# EasyEDA schematic SCH_USB_TO_TTL_CONVERTOR.json
TITLE: Sheet_1; REV: 1.0; Date: 2024-04-29; Sheet: 1/1; Drawn By: janardhanbv; Company: Your Company
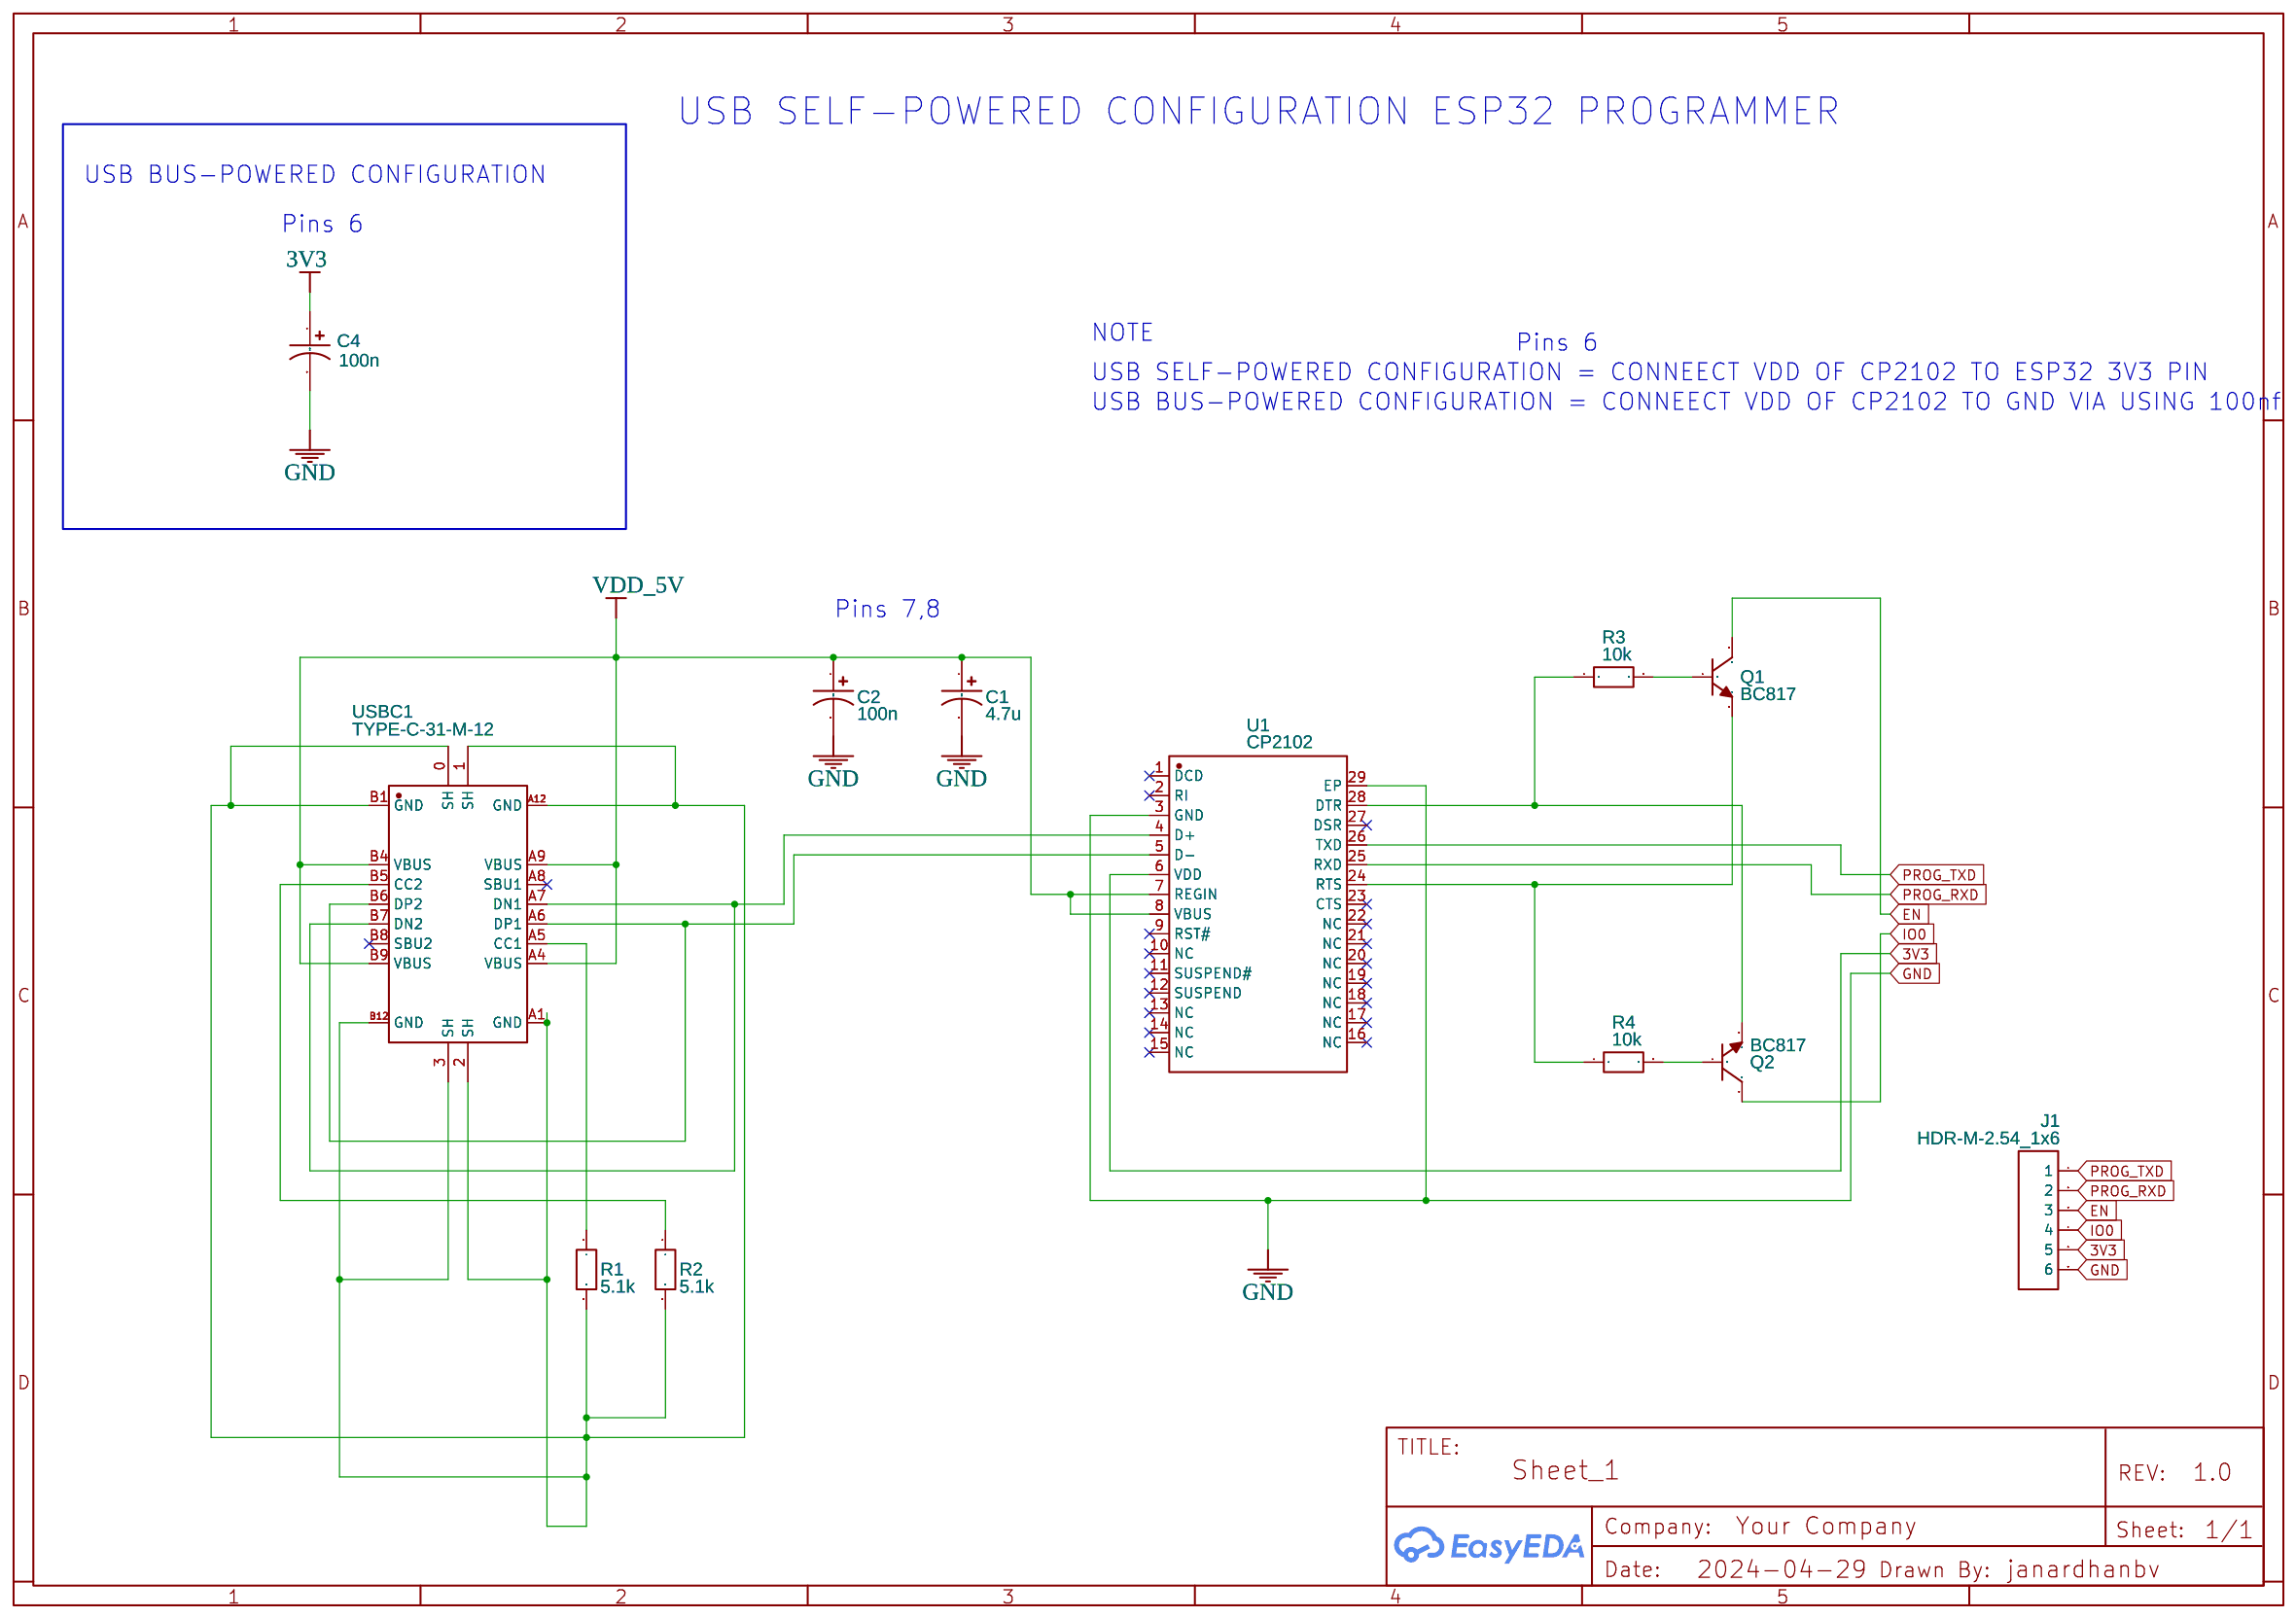
[diagram p0: schematic sheet]

## Parts
C1  4.7u  [CASE-A_3216]
C2  100n  [CASE-A_3216]
C4  100n  [CASE-A_3216]
J1  HDR-M-2.54_1x6  [HDR-M-2.54_1X6]
Q1  BC817  [SOT-23-3_L2.9-W1.3-P1.90-LS2.4-BR]
Q2  BC817  [SOT-23-3_L2.9-W1.3-P1.90-LS2.4-BR]
R1  5.1k  [R0603]
R2  5.1k  [R0603]
R3  10k  [R0603]
R4  10k  [R0603]
U1  CP2102  [QFN-28_L5.0-W5.0-P0.50-TL-EP3.2]
USBC1  TYPE-C-31-M-12  [USB-C_SMD-TYPE-C-31-M-12]

## Library data of the parts
C1 C2 C4 = C_Tan_SMD_A_US: Contributor: LCEDA_Lib
J1 = HDR-M-2.54_1x6: Supplier Part: C190819; Supplier: LCSC; Contributor: LCEDA_Lib
Q1 Q2 = BC817: Supplier: LCSC; Manufacturer: CJ(江苏长电/长晶); Manufacturer Part: BC817-40; Supplier Part: C8589; JLCPCB Part Class: Extended Part
R1-R4 = R_0603_EU: Contributor: LCEDA_Lib
U1 = CP2102: Contributor: LCSC; Supplier: LCSC; Supplier Part: C9900004371; Manufacturer: null
USBC1 = TYPE-C-31-M-12: Contributor: LCSC; Supplier: LCSC; Supplier Part: C165948; Manufacturer: 韩国韩荣; JLCPCB Part Class: Extended Part

## Nets
3V3: C4.1 J1.5 U1.6(VDD)
GND: C1.2 C2.2 C4.2 J1.6 U1.3(GND) U1.29(EP)
VDD_5V: C1.1 C2.1 U1.7(REGIN) U1.8(VBUS) USBC1.A4(VBUS) USBC1.A9(VBUS) USBC1.B4(VBUS) USBC1.B9(VBUS)
EN: J1.3 Q1.3(C)
IO0: J1.4 Q2.3(C)
PROG_RXD: J1.2 U1.25(RXD)
PROG_TXD: J1.1 U1.26(TXD)
Net-(Q1-1): Q1.1(B) R3.2
Net-(Q1-2): Q1.2(E) R4.1 U1.24(RTS)
Net-(Q2-1): Q2.1(B) R4.2
Net-(Q2-2): Q2.2(E) R3.1 U1.28(DTR)
Net-(R1-1): R1.1 USBC1.A5(CC1)
Net-(R1-2): R1.2 R2.2 USBC1.0(SH) USBC1.1(SH) USBC1.2(SH) USBC1.3(SH) USBC1.A1(GND) USBC1.A12(GND) USBC1.B1(GND) USBC1.B12(GND)
Net-(R2-1): R2.1 USBC1.B5(CC2)
Net-(U1-4): U1.4(D+) USBC1.A7(DN1) USBC1.B7(DN2)
Net-(U1-5): U1.5(D-) USBC1.A6(DP1) USBC1.B6(DP2)

Not connected (* = marked no-connect by the designer): U1 1(DCD)* 2(RI)* 9(RST#)* 10(NC)* 11(SUSPEND#)* 12(SUSPEND)* 13(NC)* 14(NC)* 15(NC)* 16(NC)* 17(NC)* 18(NC)* 19(NC)* 20(NC)* 21(NC)* 22(NC)* 23(CTS)* 27(DSR)*; USBC1 A8(SBU1)* B8(SBU2)*

## Notes on the sheet
- USB SELF-POWERED CONFIGURATION ESP32 PROGRAMMER
- USB BUS-POWERED CONFIGURATION
- Pins 6
- NOTE
- Pins 6
- USB SELF-POWERED CONFIGURATION = CONNEECT VDD OF CP2102 TO ESP32 3V3 PIN
- USB BUS-POWERED CONFIGURATION = CONNEECT VDD OF CP2102 TO GND VIA USING 100nf
- Pins 7,8
